# EAGLE design esp8266-incubator (EAGLE 6.4)

## Sheet 1 of 7: CPU
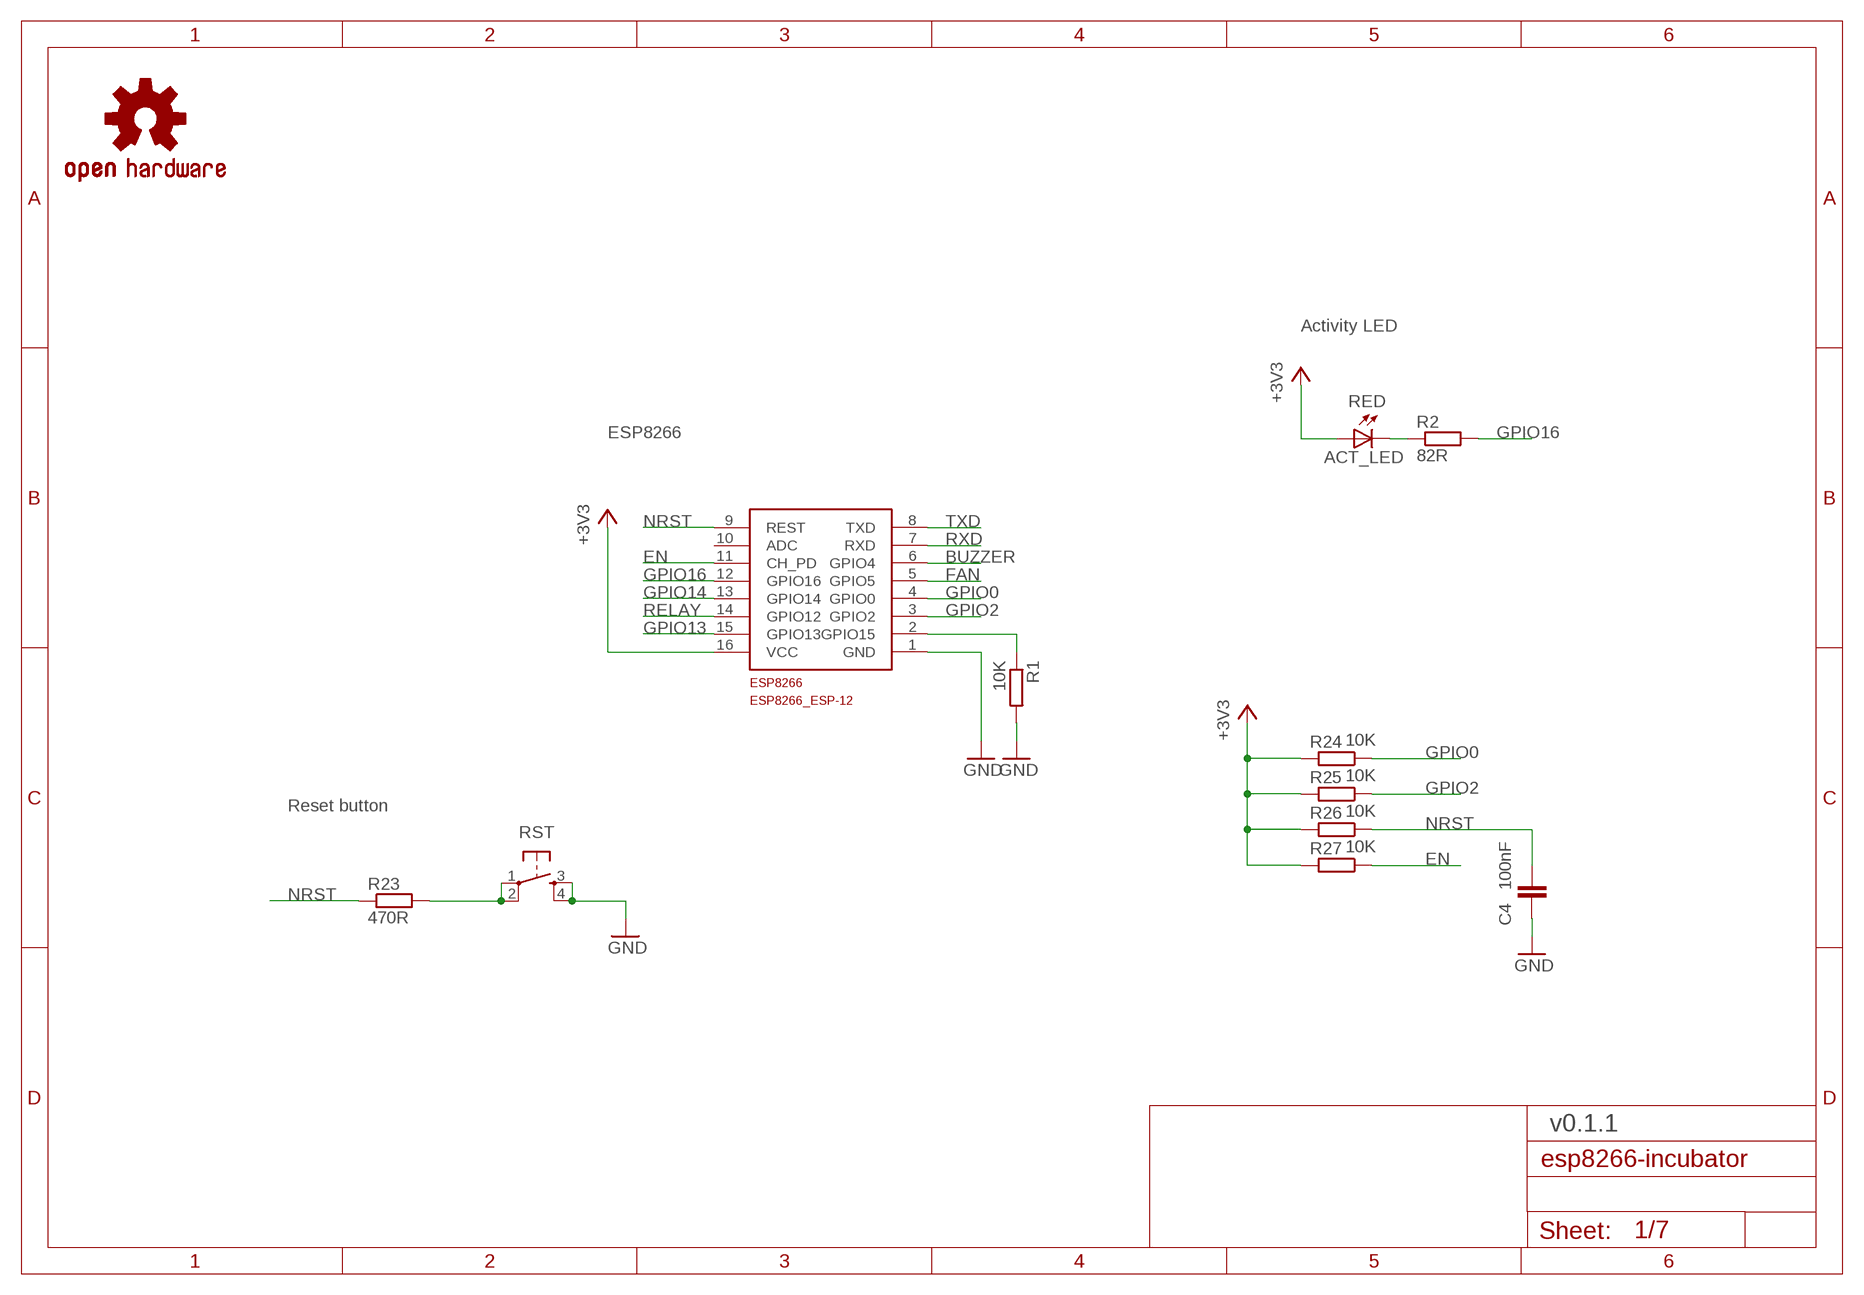
[diagram p0: schematic, sheet 1]

### Parts
ACT_LED  RED  LEDSMT1206  [1206]
C4  100nF  C-EUC0805  [C0805]
ESP8266  ESP8266_ESP-12  [ESP8266-ESP12]
R1  10K  R-EU_R0805  [R0805]
R2  82R  R-EU_R0805  [R0805]
R23  470R  R-EU_R0805  [R0805]
R24  10K  R-EU_R0805  [R0805]
R25  10K  R-EU_R0805  [R0805]
R26  10K  R-EU_R0805  [R0805]
R27  10K  R-EU_R0805  [R0805]
RST  TAC_SWITCHPTH  [TACTILE-PTH]
U$1000  OSHW-LOGOL  [OSHW-LOGO-L]

### Nets
+3V3: ACT_LED.A ESP8266.16(VCC) R24.2 R25.2 R26.2 R27.2 ; also sheet 2,3,4,5,6,7
BUZZER: ESP8266.6(GPIO4) ; also sheet 7
EN: ESP8266.11(CH_PD) R27.1
FAN: ESP8266.5(GPIO5) ; also sheet 3
GND: C4.1 ESP8266.1(GND) R1.2 RST.3 RST.4 ; also sheet 2,3,4,5,6,7
GPIO0: ESP8266.4(GPIO0) R24.1 ; also sheet 2
GPIO2: ESP8266.3(GPIO2) R25.1
GPIO13: ESP8266.15(GPIO13) ; also sheet 6
GPIO14: ESP8266.13(GPIO14) ; also sheet 6
GPIO16: ESP8266.12(GPIO16) R2.2
N$1: ACT_LED.C R2.1
N$5: ESP8266.2(GPIO15) R1.1
N$26: R23.2 RST.1 RST.2
NRST: C4.2 ESP8266.9(REST) R23.1 R26.1 ; also sheet 2
RELAY: ESP8266.14(GPIO12) ; also sheet 4
RXD: ESP8266.7(RXD) ; also sheet 2,6
TXD: ESP8266.8(TXD) ; also sheet 2,6
Unconnected: ESP8266.10(ADC)

### Notes on the sheet
- Activity LED
- ESP8266
- Reset button
- v0.1.1

## Sheet 2 of 7: Programming
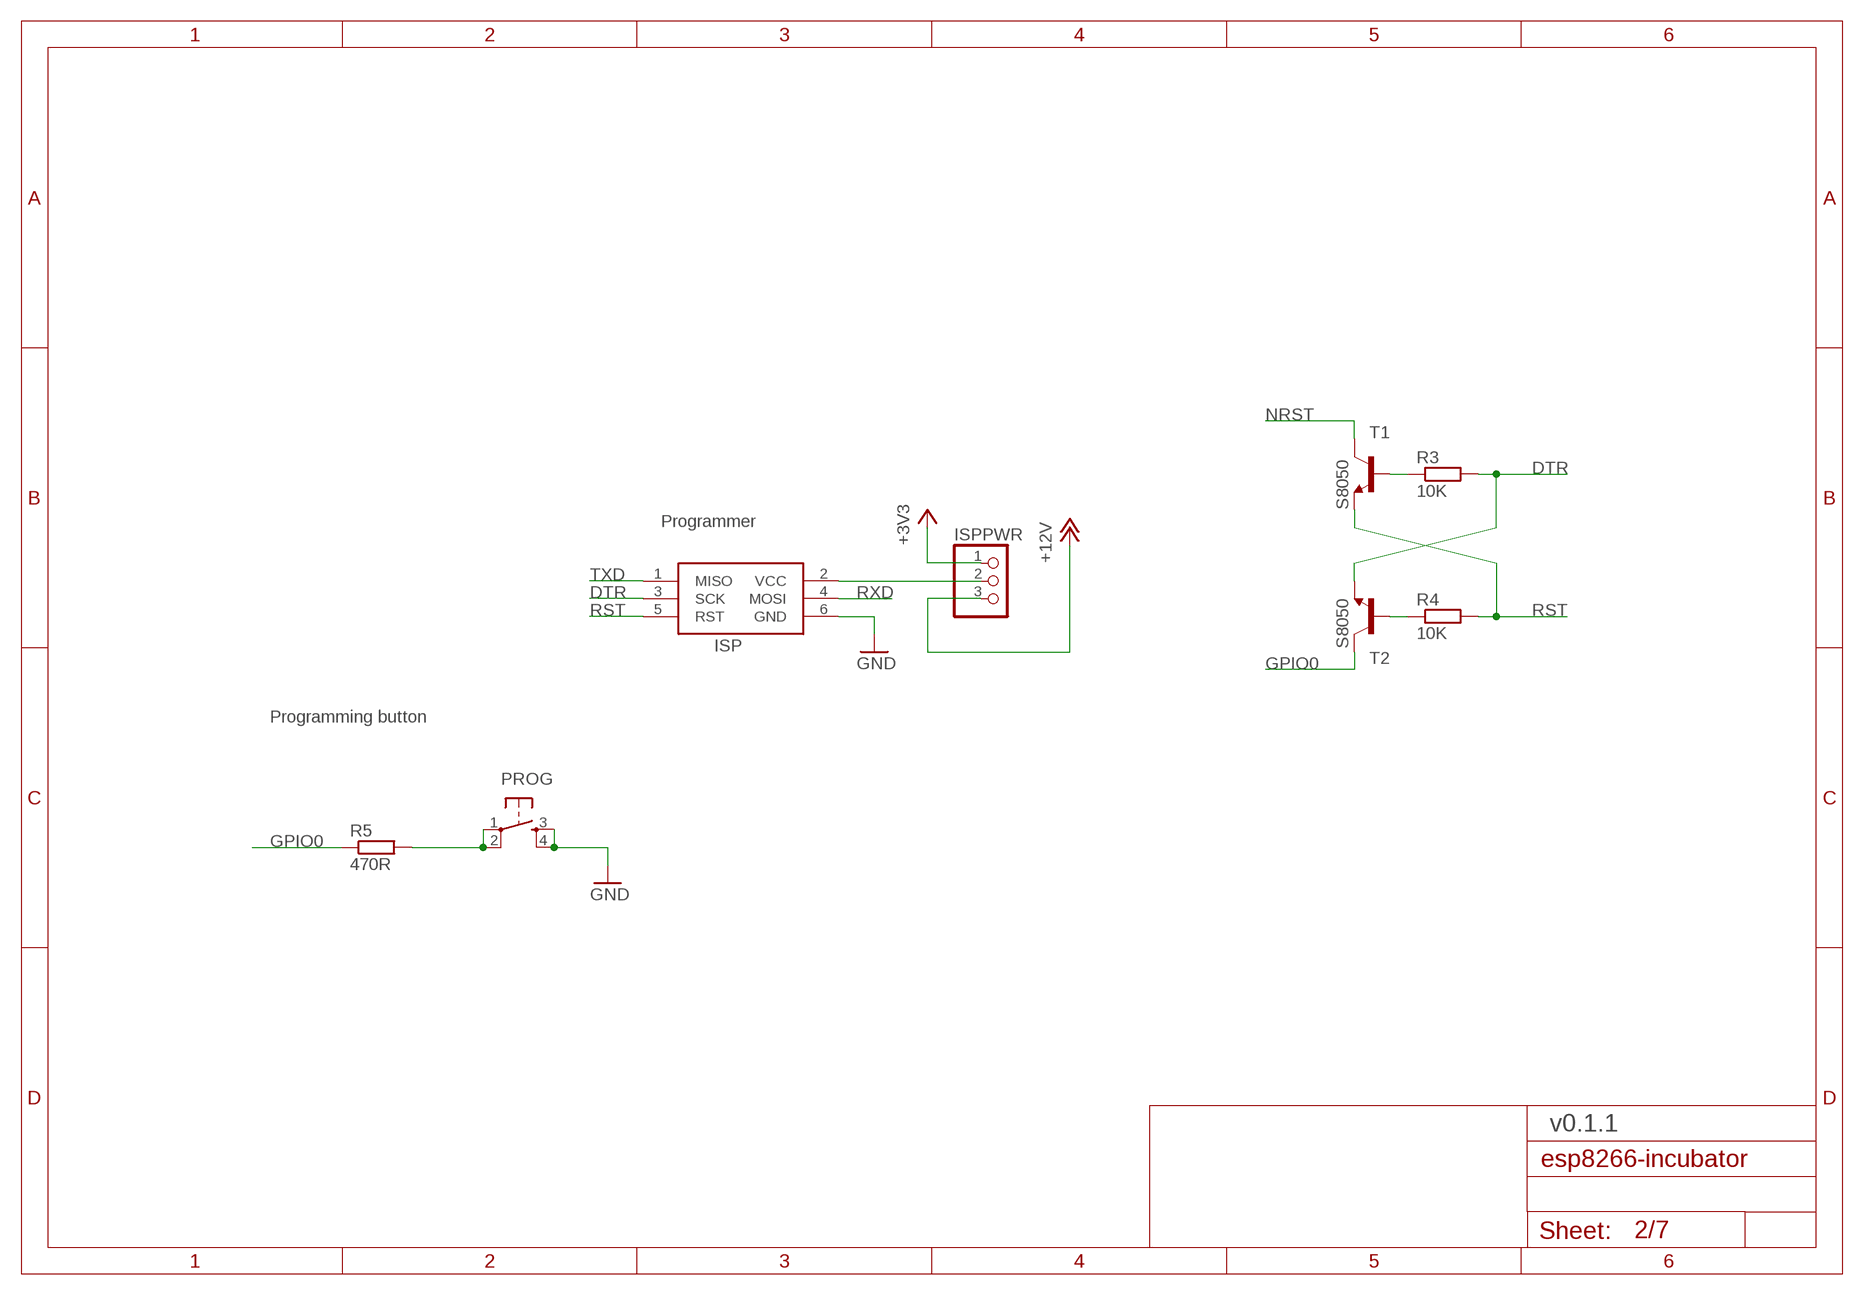
[diagram p1: schematic, sheet 2]

### Parts
ISP  AVRISP-6  [AVRISP]
ISPPWR  PINHD-1X3  [1X03]
PROG  TAC_SWITCHPTH  [TACTILE-PTH]
R3  10K  R-EU_R0805  [R0805]
R4  10K  R-EU_R0805  [R0805]
R5  470R  R-EU_R0805  [R0805]
T1  S8050  BC808-NPN-SOT23-BEC  [SOT23-BEC]
T2  S8050  BC808-NPN-SOT23-BEC  [SOT23-BEC]

### Nets
+3V3: ISPPWR.1 ; also sheet 1,3,4,5,6,7
+12V: ISPPWR.3 ; also sheet 3,5
DTR: ISP.3(SCK) R3.2 T2.E
GND: ISP.6(GND) PROG.3 PROG.4 ; also sheet 1,3,4,5,6,7
GPIO0: R5.1 T2.C ; also sheet 1
N$3: R3.1 T1.B
N$4: PROG.1 PROG.2 R5.2
N$6: ISP.2(VCC) ISPPWR.2
N$7: R4.1 T2.B
NRST: T1.C ; also sheet 1
RST: ISP.5(RST) R4.2 T1.E
RXD: ISP.4(MOSI) ; also sheet 1,6
TXD: ISP.1(MISO) ; also sheet 1,6

### Notes on the sheet
- Programmer
- Programming button
- v0.1.1

## Sheet 3 of 7: Fan
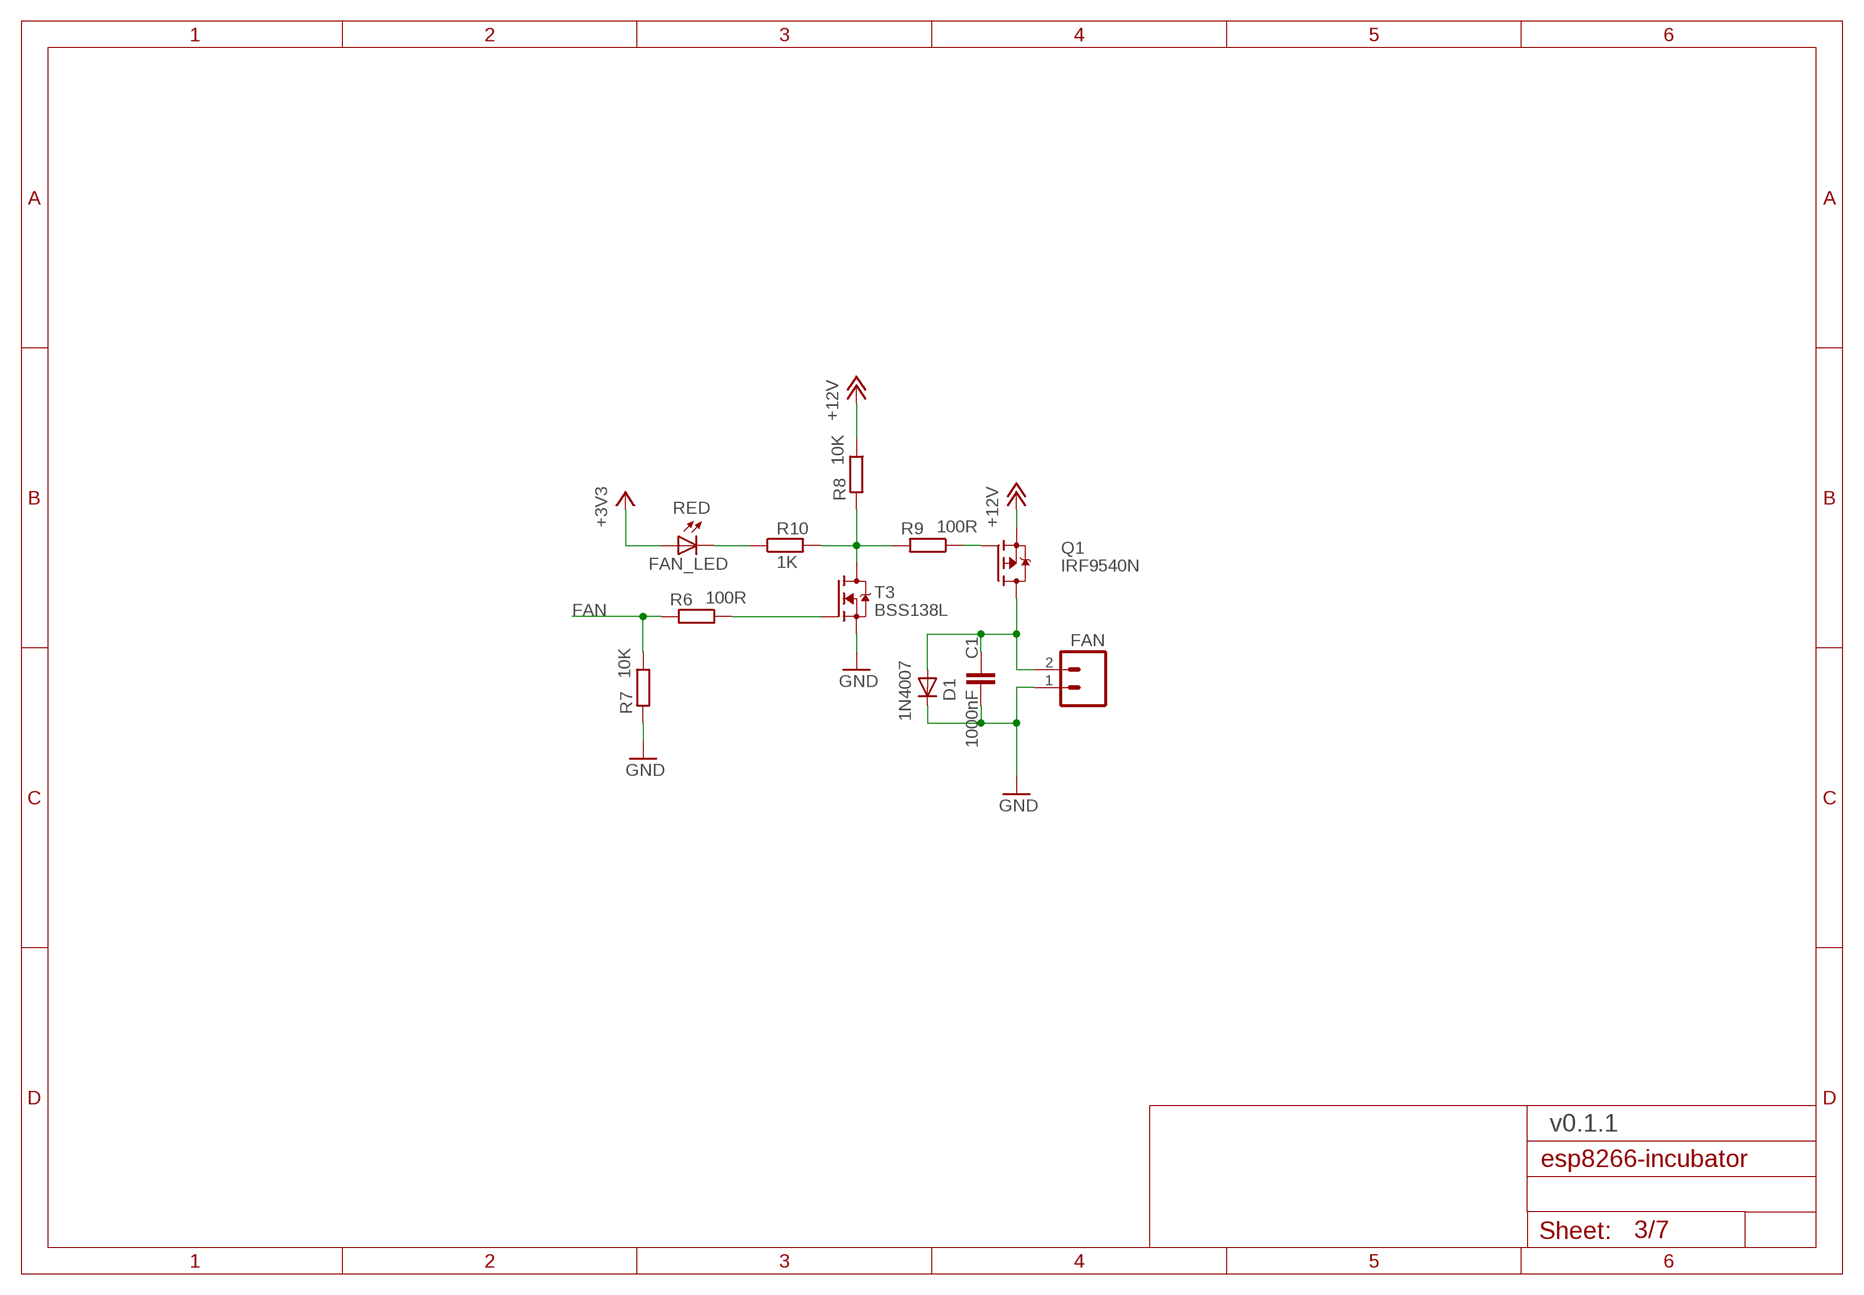
[diagram p2: schematic, sheet 3]

### Parts
C1  1000nF  C-EUC0805  [C0805]
D1  1N4007  DIODE-MELF-MLL41  [MELF-MLL41]
FAN  M025MM  [SCREWTERMINAL-5MM-2]
FAN_LED  RED  LEDSMT1206  [1206]
Q1  IRF9540N  MOSFET-PGDS_TO220V  [TO220V]
R6  100R  R-EU_R0805  [R0805]
R7  10K  R-EU_R0805  [R0805]
R8  10K  R-EU_R0805  [R0805]
R9  100R  R-EU_R0805  [R0805]
R10  1K  R-EU_R0805  [R0805]
T3  BSS138L  MOSFET-N-SOT23  [SOT23]

### Nets
+3V3: FAN_LED.A ; also sheet 1,2,4,5,6,7
+12V: Q1.3(S) R8.1 ; also sheet 2,5
FAN: R6.2 R7.1 ; also sheet 1
GND: C1.1 D1.C FAN.1 R7.2 T3.2(S) ; also sheet 1,2,4,5,6,7
N$18: Q1.1(G) R9.1
N$22: FAN_LED.C R10.1
N$23: R6.1 T3.1(G)
N$24: R8.2 R9.2 R10.2 T3.3(D)
N$25: C1.2 D1.A FAN.2 Q1.2(D)

### Notes on the sheet
- v0.1.1

## Sheet 4 of 7: Relays
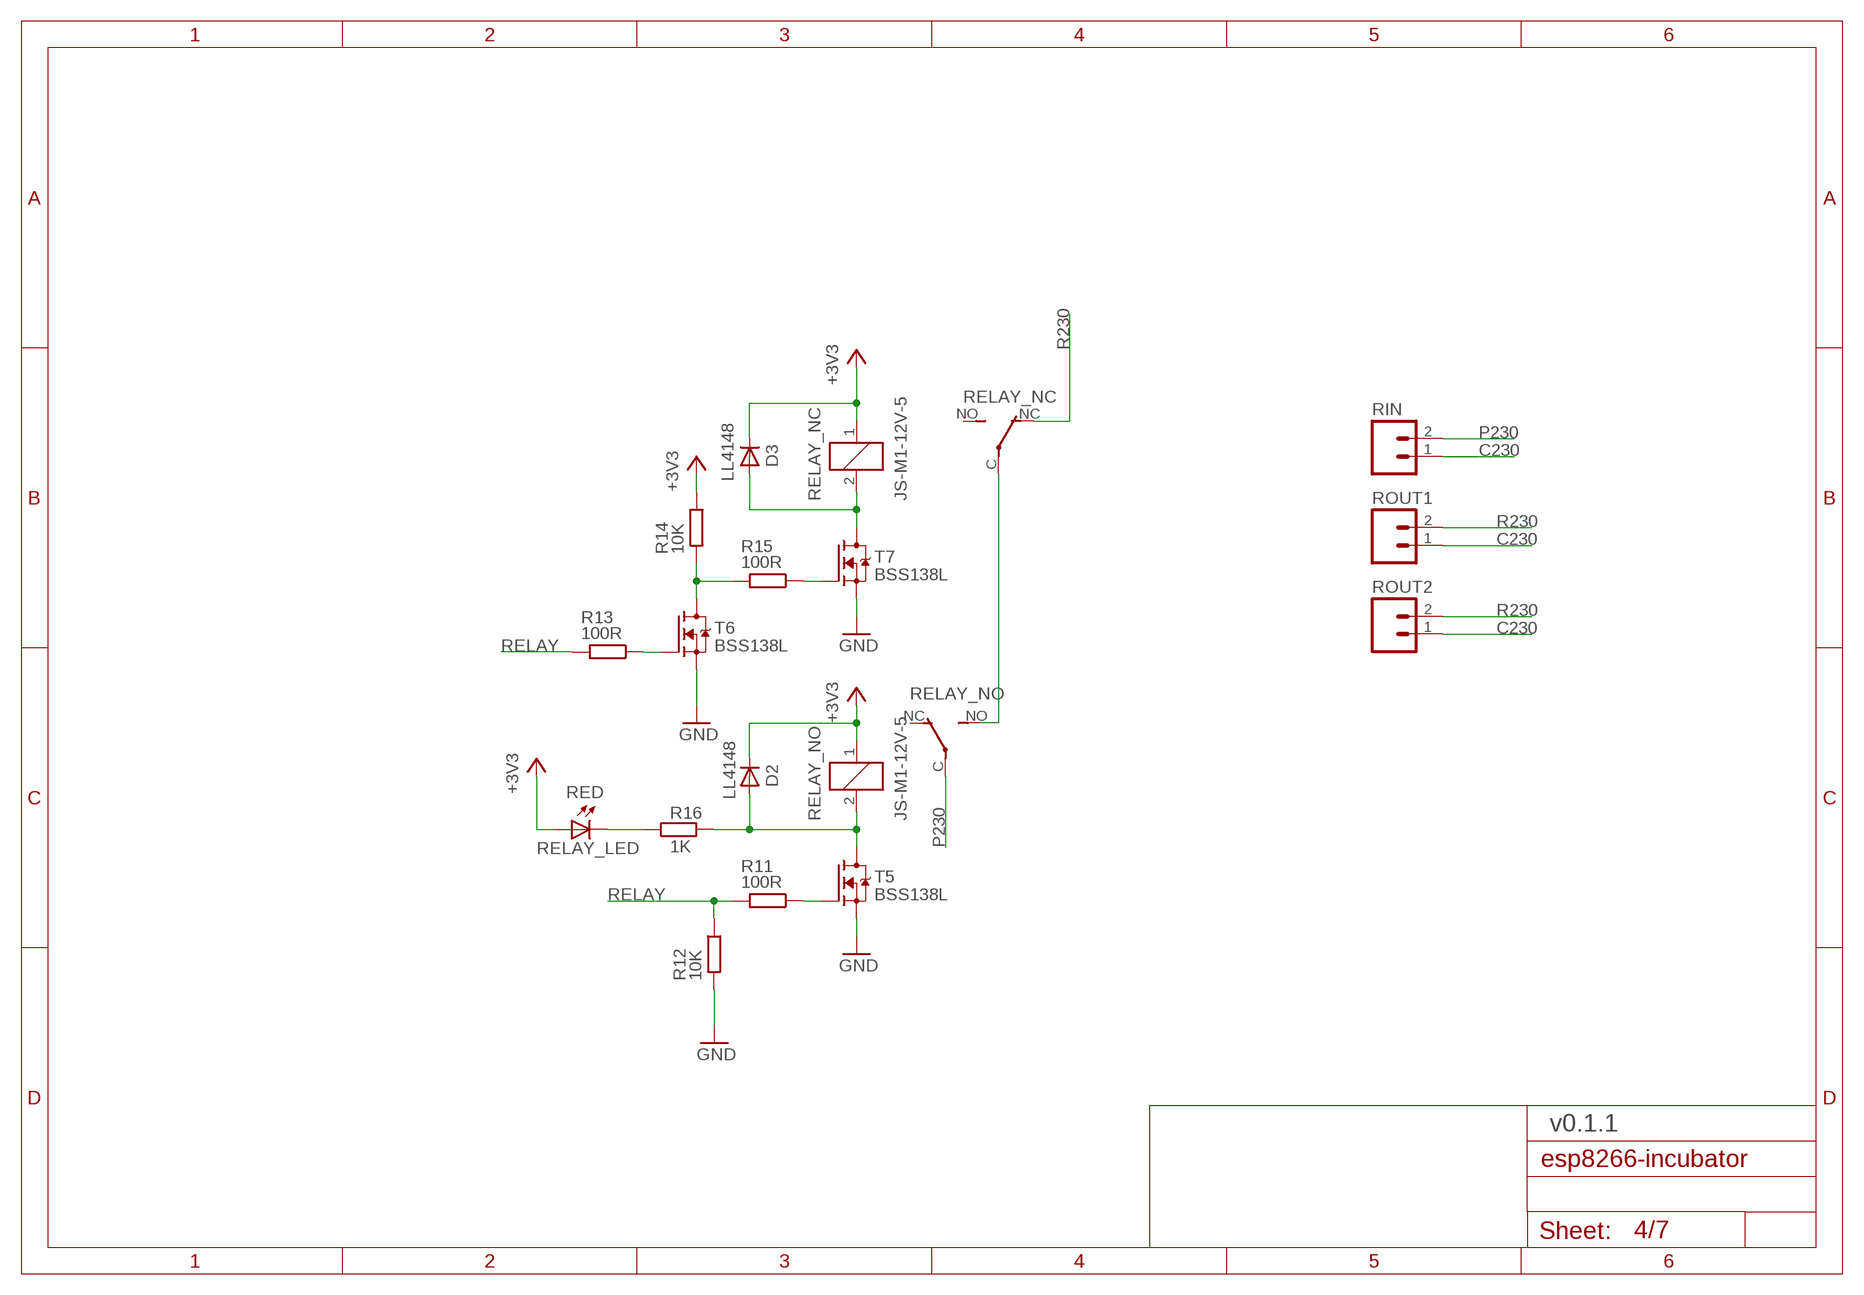
[diagram p3: schematic, sheet 4]

### Parts
D2  LL4148  PMLL4150  [SOD80C]
D3  LL4148  PMLL4150  [SOD80C]
R11  100R  R-EU_R0805  [R0805]
R12  10K  R-EU_R0805  [R0805]
R13  100R  R-EU_R0805  [R0805]
R14  10K  R-EU_R0805  [R0805]
R15  100R  R-EU_R0805  [R0805]
R16  1K  R-EU_R0805  [R0805]
RELAY_LED  RED  LEDSMT1206  [1206]
RELAY_NC  JS-M1-12V-5  [JS-M]
RELAY_NO  JS-M1-12V-5  [JS-M]
RIN  M025MM  [SCREWTERMINAL-5MM-2]
ROUT1  M025MM  [SCREWTERMINAL-5MM-2]
ROUT2  M025MM  [SCREWTERMINAL-5MM-2]
T5  BSS138L  MOSFET-N-SOT23  [SOT23]
T6  BSS138L  MOSFET-N-SOT23  [SOT23]
T7  BSS138L  MOSFET-N-SOT23  [SOT23]

### Nets
+3V3: D2.C D3.C R14.1 RELAY_LED.A RELAY_NC.1 RELAY_NO.1 ; also sheet 1,2,3,5,6,7
C230: RIN.1 ROUT1.1 ROUT2.1
GND: R12.2 T5.2(S) T6.2(S) T7.2(S) ; also sheet 1,2,3,5,6,7
N$9: D2.A R16.2 RELAY_NO.2 T5.3(D)
N$11: R11.1 T5.1(G)
N$12: R13.1 T6.1(G)
N$13: R14.2 R15.2 T6.3(D)
N$14: R15.1 T7.1(G)
N$15: R16.1 RELAY_LED.C
N$16: D3.A RELAY_NC.2 T7.3(D)
N$17: RELAY_NC.C(2:P) RELAY_NO.NO(2:S)
P230: RELAY_NO.C(2:P) RIN.2
R230: RELAY_NC.NC(2:O) ROUT1.2 ROUT2.2
RELAY: R11.2 R12.1 R13.2 ; also sheet 1
Unconnected: RELAY_NC.NO(2:S) RELAY_NO.NC(2:O)

### Notes on the sheet
- v0.1.1

## Sheet 5 of 7: Power
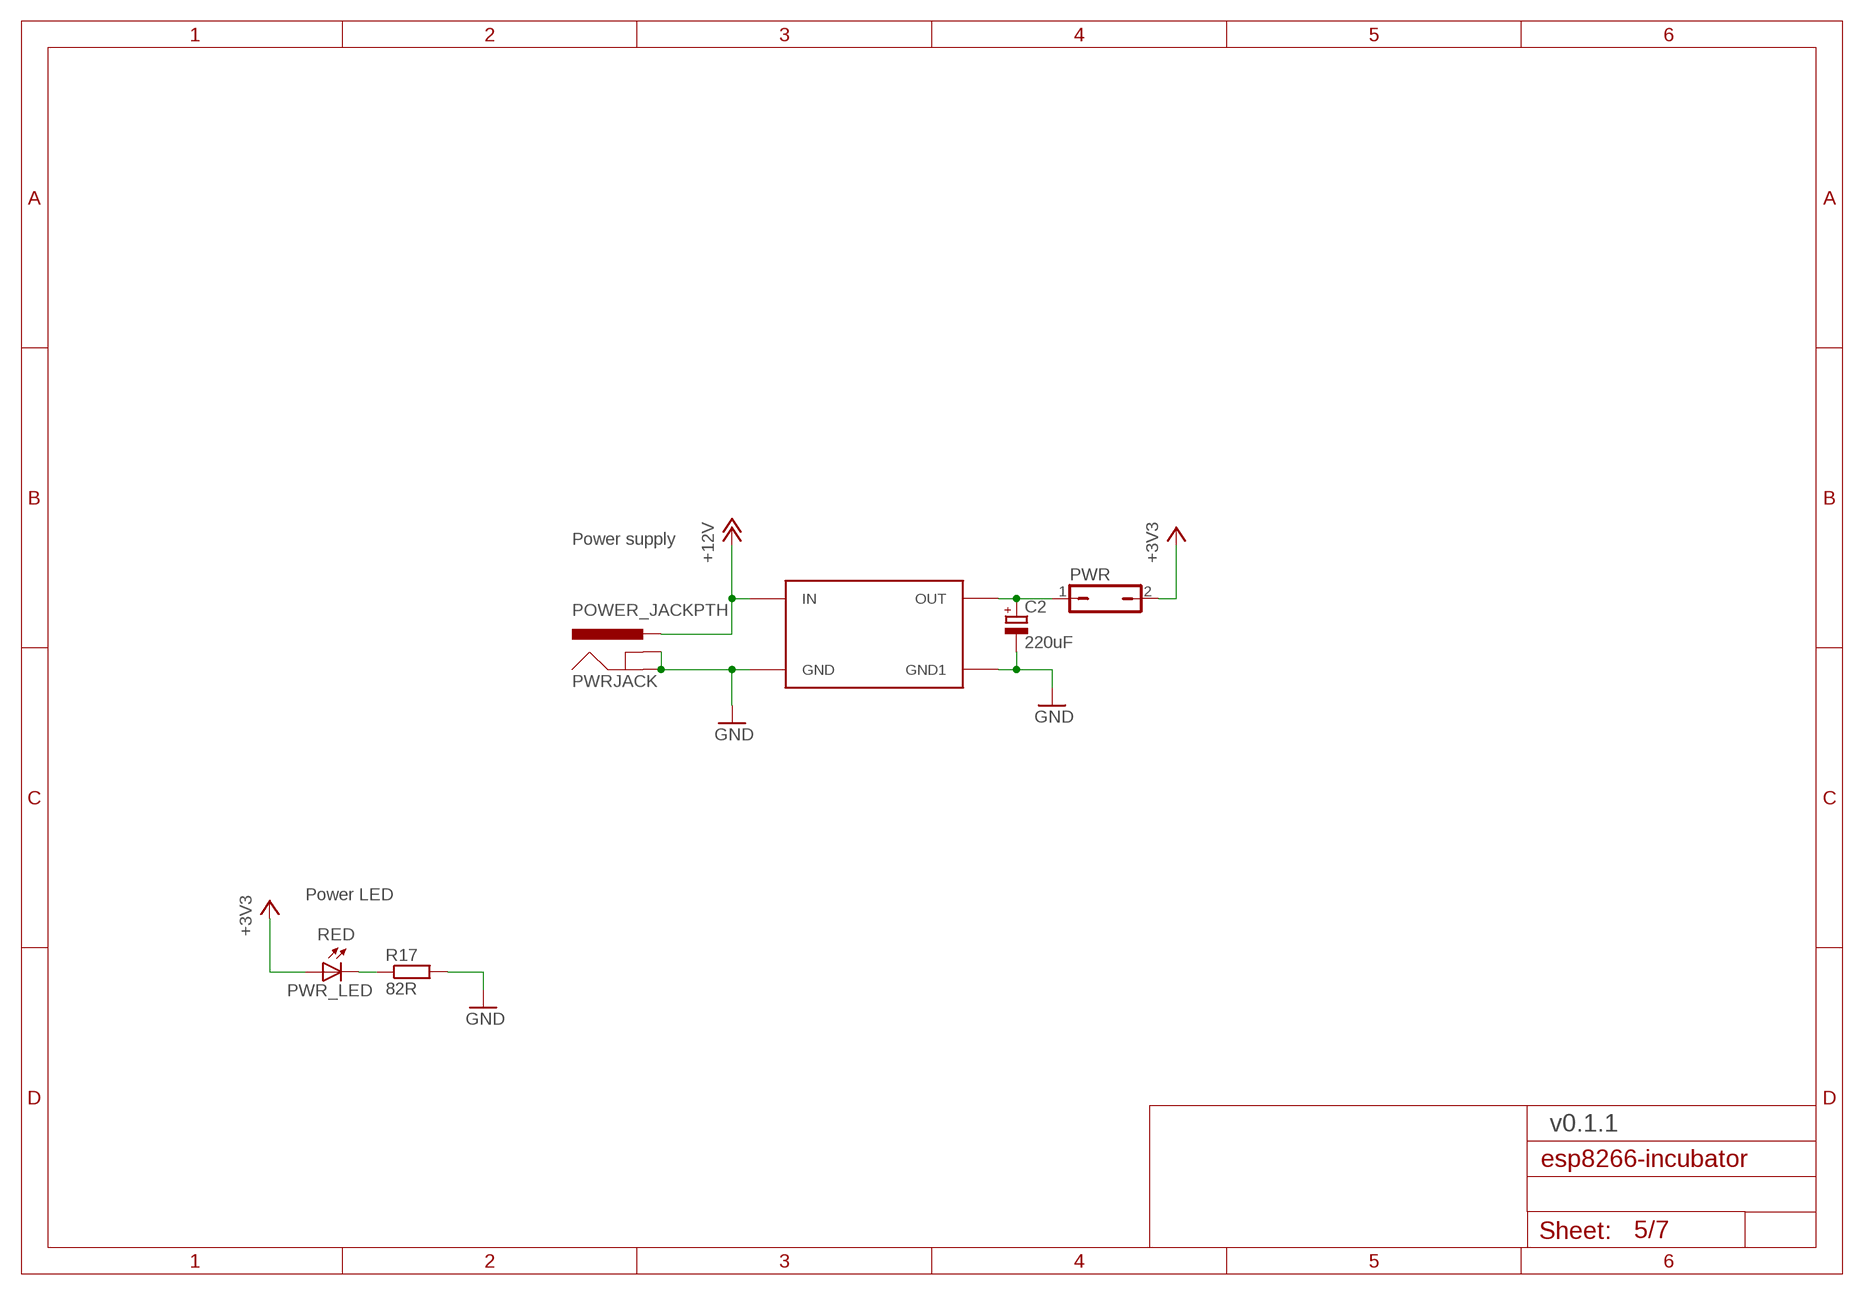
[diagram p4: schematic, sheet 5]

### Parts
C2  220uF  CPOL-EUE2.5-6  [E2,5-6]
PWR  JP1Q  [JP1]
PWR_LED  RED  LEDSMT1206  [1206]
PWR_SUPPLY  DC-DC-SMALL  [DC-DC]
PWRJACK  POWER_JACKPTH  [POWER_JACK_PTH]
R17  82R  R-EU_R0805  [R0805]

### Nets
+3V3: PWR.2 PWR_LED.A ; also sheet 1,2,3,4,6,7
+12V: PWR_SUPPLY.P$1(IN) PWRJACK.PWR ; also sheet 2,3
GND: C2.- PWR_SUPPLY.P$3(GND) PWR_SUPPLY.P$4(GND1) PWRJACK.GND PWRJACK.GNDBREAK R17.2 ; also sheet 1,2,3,4,6,7
N$2: C2.+ PWR.1 PWR_SUPPLY.P$2(OUT)
N$21: PWR_LED.C R17.1

### Notes on the sheet
- Power supply
- Power LED
- v0.1.1

## Sheet 6 of 7: Sensor
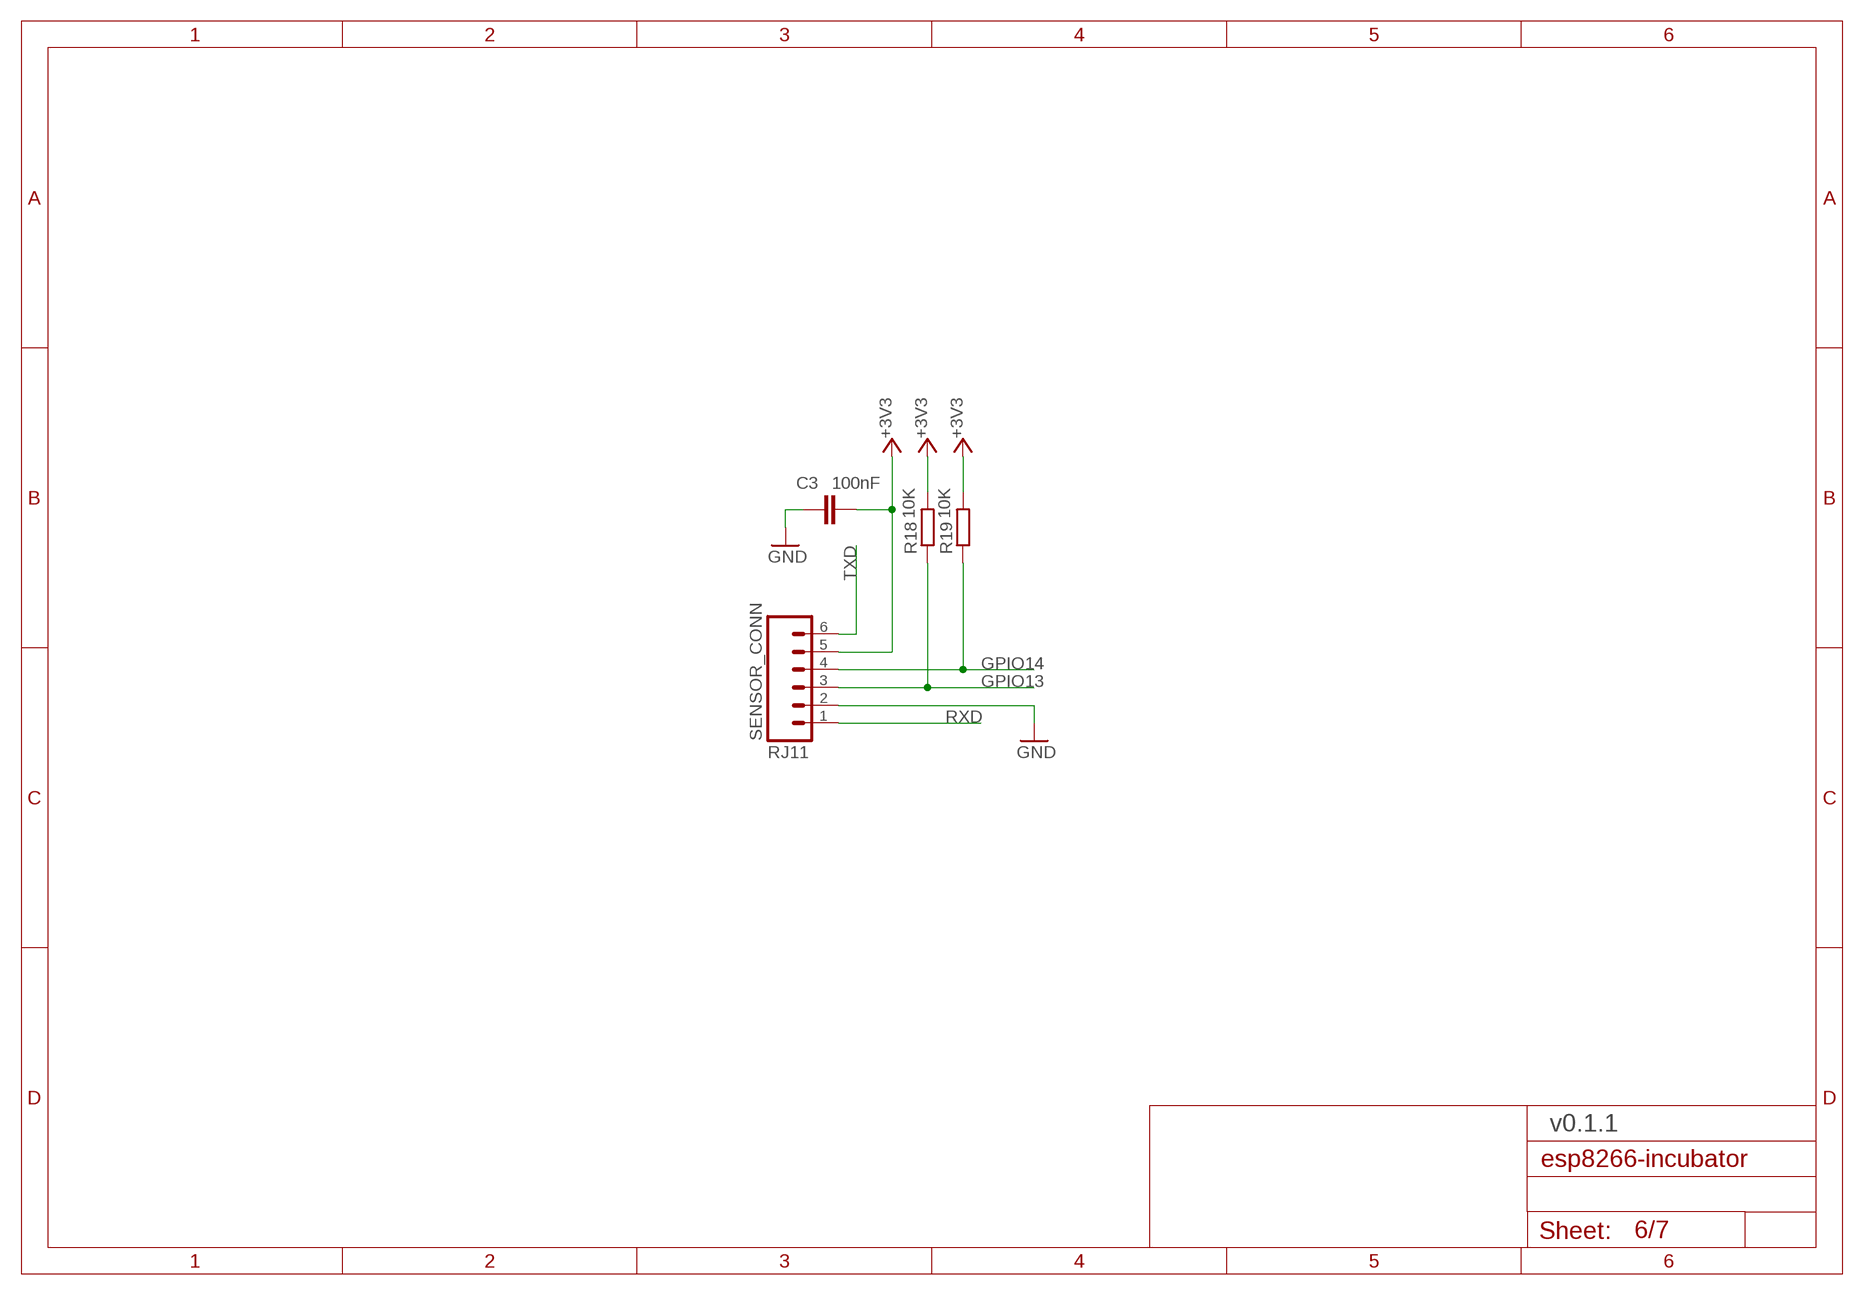
[diagram p5: schematic, sheet 6]

### Parts
C3  100nF  C-EUC0805  [C0805]
R18  10K  R-EU_R0805  [R0805]
R19  10K  R-EU_R0805  [R0805]
SENSOR_CONN  RJ11  RJ11-6PTH  [RJ11-6]

### Nets
+3V3: C3.2 R18.2 R19.2 SENSOR_CONN.5 ; also sheet 1,2,3,4,5,7
GND: C3.1 SENSOR_CONN.2 ; also sheet 1,2,3,4,5,7
GPIO13: R18.1 SENSOR_CONN.3 ; also sheet 1
GPIO14: R19.1 SENSOR_CONN.4 ; also sheet 1
RXD: SENSOR_CONN.1 ; also sheet 1,2
TXD: SENSOR_CONN.6 ; also sheet 1,2

### Notes on the sheet
- v0.1.1

## Sheet 7 of 7: Alarm
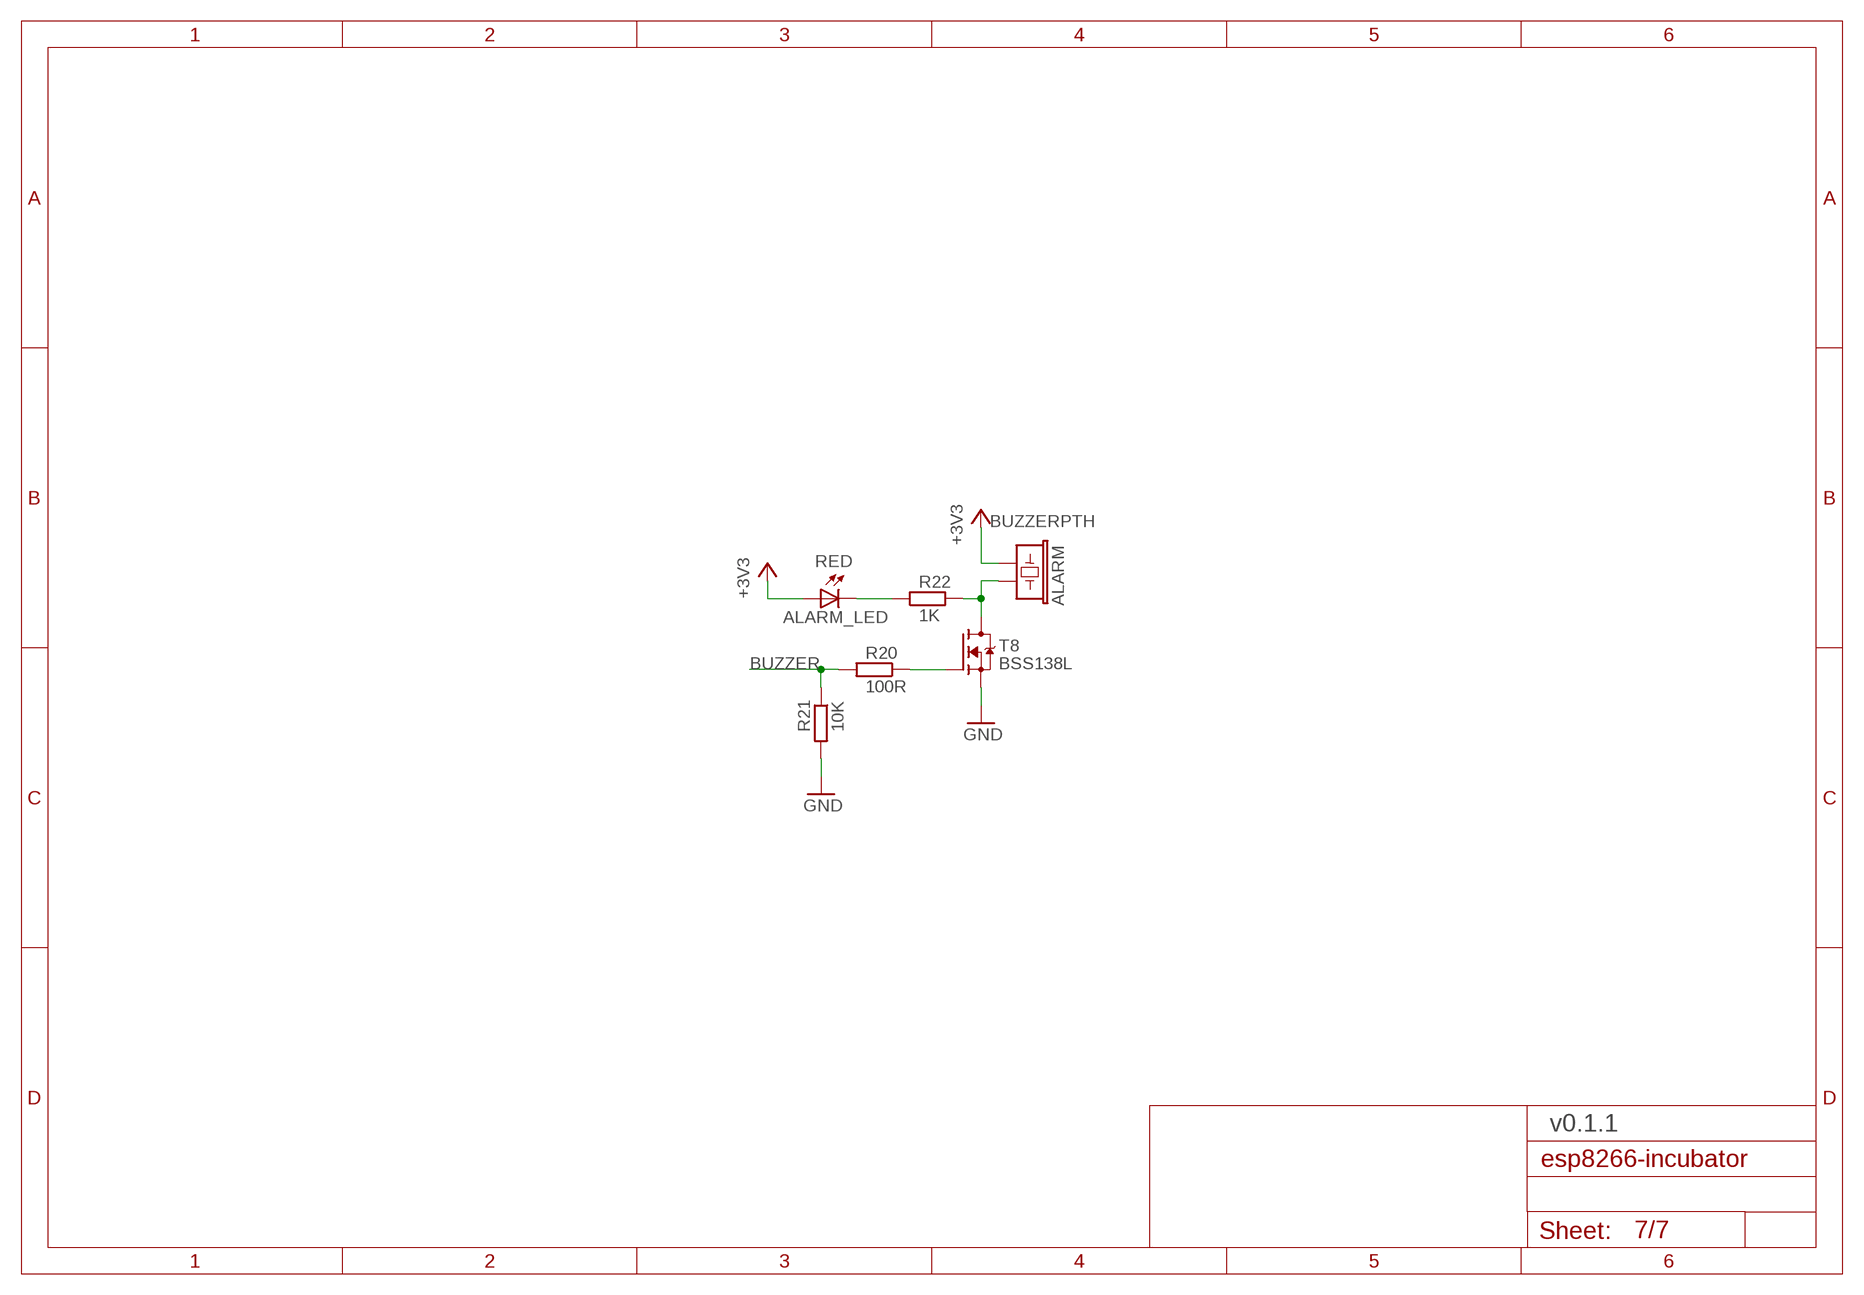
[diagram p6: schematic, sheet 7]

### Parts
ALARM  BUZZERPTH  [BUZZER-12MM]
ALARM_LED  RED  LEDSMT1206  [1206]
R20  100R  R-EU_R0805  [R0805]
R21  10K  R-EU_R0805  [R0805]
R22  1K  R-EU_R0805  [R0805]
T8  BSS138L  MOSFET-N-SOT23  [SOT23]

### Nets
+3V3: ALARM.+ ALARM_LED.A ; also sheet 1,2,3,4,5,6
BUZZER: R20.2 R21.1 ; also sheet 1
GND: R21.2 T8.2(S) ; also sheet 1,2,3,4,5,6
N$8: R20.1 T8.1(G)
N$19: ALARM_LED.C R22.1
N$20: ALARM.- R22.2 T8.3(D)

### Notes on the sheet
- v0.1.1

## Library data of the parts
ACT_LED ALARM_LED FAN_LED PWR_LED RELAY_LED = led:LED: LED OSRAM: - CHIPLED LG R971, LG N971, LY N971, LG Q971, LY Q971, LO R971, LY R971 LH N974, LH R974 LS Q976, LO Q976, LY Q976 LO Q996 - Hyper CHIPLED LW Q18S LB Q993, LB Q99A, LB R99A - SideLED LS A670, LO A670, LY A670, LG A670, LP A670 LB A673, LV A673, LT A673, LW A673 LH A674 LY A675 LS A676, LA A676, LO A676, LY A676, LW A676 LS A679, LY A679, LG A679 - Hyper Micro SIDELED® LS Y876, LA Y876, LO Y876, LY Y876 LT Y87S - SmartLED LW L88C, LW L88S LB L89C, LB L89S, LG L890 LS L89K, LO L89K, LY L89K LS L896, LA L896, LO L896, LY L896 - TOPLED LS T670, LO T670, LY T670, LG T670, LP T670 LSG T670, LSP T670, LSY T670, LOP T670, LYG T670 LG T671, LOG T671, LSG T671 LB T673, LV T673, LT T673, LW T673 LH T674 LS T676, LA T676, LO T676, LY T676, LB T676, LH T676, LSB T676, LW T676 LB T67C, LV T67C, LT T67C, LS T67K, LO T67K, LY T67K, LW E67C LS E67B, LA E67B, LO E67B, LY E67B, LB E67C, LV E67C, LT E67C LW T67C LS T679, LY T679, LG T679 LS T770, LO T770, LY T770, LG T770, LP T770 LB T773, LV T773, LT T773, LW T773 LH T774 LS E675, LA E675, LY E675, LS T675 LS T776, LA T776, LO T776, LY T776, LB T776 LHGB T686 LT T68C, LB T68C - Hyper Mini TOPLED® LB M676 - Mini TOPLED Santana® LG M470 LS M47K, LO M47K, LY M47K Source: http://www.osram.convergy.de LUXEON: - LUMILED® LXK2-PW12-R00, LXK2-PW12-S00, LXK2-PW14-U00, LXK2-PW14-V00 LXK2-PM12-R00, LXK2-PM12-S00, LXK2-PM14-U00 LXK2-PE12-Q00, LXK2-PE12-R00, LXK2-PE12-S00, LXK2-PE14-T00, LXK2-PE14-U00 LXK2-PB12-K00, LXK2-PB12-L00, LXK2-PB12-M00, LXK2-PB14-N00, LXK2-PB14-P00, LXK2-PB14-Q00 LXK2-PR12-L00, LXK2-PR12-M00, LXK2-PR14-Q00, LXK2-PR14-R00 LXK2-PD12-Q00, LXK2-PD12-R00, LXK2-PD12-S00 LXK2-PH12-R00, LXK2-PH12-S00 LXK2-PL12-P00, LXK2-PL12-Q00, LXK2-PL12-R00 Source: www.luxeon.com KINGBRIGHT: KA-3528ASYC Source: www.kingbright.com
ALARM = SparkFun:BUZZER: Buzzer 12mm Spark Fun Electronics SKU : Comp-Buzzer
C1 C3 C4 = rcl:C-EU: CAPACITOR, European symbol
C2 = rcl:CPOL-EU: POLARIZED CAPACITOR, European symbol
D1 = diode:DIODE-: DIODE
D2 D3 = diode:PMLL4150: DIODE high speed
ESP8266 = ESP8266-ESP12:ESP8266_ESP-12
FAN RIN ROUT1 ROUT2 = SparkFun-Connectors:M02: Standard 2-pin 0.1" header. Use with - straight break away headers ( PRT-00116) - right angle break away headers (PRT-00553) - swiss pins (PRT-00743) - machine pins (PRT-00117) - female headers (PRT-00115) Molex polarized connector foot print use with: PRT-08233 with associated crimp pins and housings. 2.54_SCREWTERM for use with PRT-10571. 3.5mm Screw Terminal footprints for PRT-08084 5mm Screw Terminal footprints for use with PRT-08432; STOREFRONT_ID: PRT-08432
ISP = adafruit:AVRISP: AVR ISP HEADER Standard 6 pin header for AVR programming
ISPPWR = pinhead:PINHD-1X3: PIN HEADER
PROG RST = SparkFun-Retired:TAC_SWITCH: Momentary Switch Button commonly used for reset or general input. Spark Fun Electronics SKU : COM-00097 SMT- SWCH-08247
PWR = jumper:JP1Q: JUMPER
PWR_SUPPLY = OK1CDJ-E6:DC-DC-SMALL
PWRJACK = SparkFun-Connectors:POWER_JACK: Power Jack This is the standard 5.5mm barrel jack for power. The PTH is the most common, proven, reliable, footprint. The Slot footprint only works if the mill layer is transmitted to the PCB fab house so be warned. Mating wall wart : TOL-00298 (and others); PROD_ID: CONN-08197
Q1 = adafruit:MOSFET-P
R1-R27 = rcl:R-EU_: RESISTOR, European symbol
RELAY_NC RELAY_NO = relay:JS-M1*: Automotive Ultra-Miniature Power Relay NAiS Source: http://www.mew-europe.com/.. en_ds_61211_0000.pdf
SENSOR_CONN = SparkFun-Connectors:RJ11-6: RJ11 Jack Simple 6 pin RJ11 jack. Commonly found on CAT3 devices and Microchip programmers. SKU: PRT-00132; PROD_ID: CONN-08590
T1 T2 = transistor:*-NPN-: NPN Transistror BF959 corrected 2008.03.06
T3 T5-T8 = we-transistor:MOSFET-N: N-Channel MOSFET TSM3404, IRLML2502 (Vgs>=+/-20V, Vds>=20V, Id>=3A + Rds<=0.05Ohm @ Vgs=4.5V) BSS138 (Vgs>=+/-20V, Vds>=40V, Id>=0.2A + Rds<=3Ohm @ Vgs=4.5V)
U$1000 = SparkFun:OSHW-LOGO: Open Source Hardware Logo This logo indicates the piece of hardware it is found on incorporates a OSHW license and/or adheres to the definition of open source hardware found here: http://freedomdefined.org/OSHW

## Board
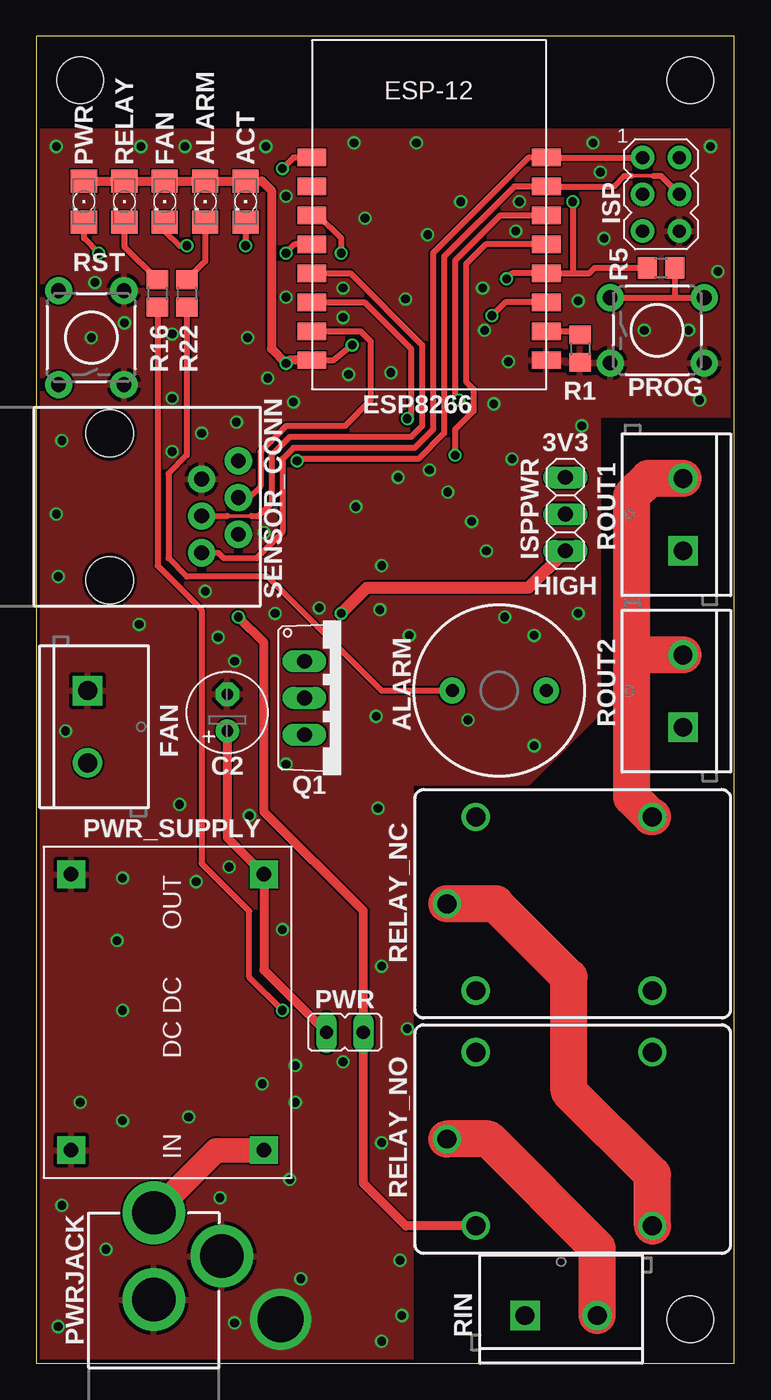
[diagram p7: board, top side]
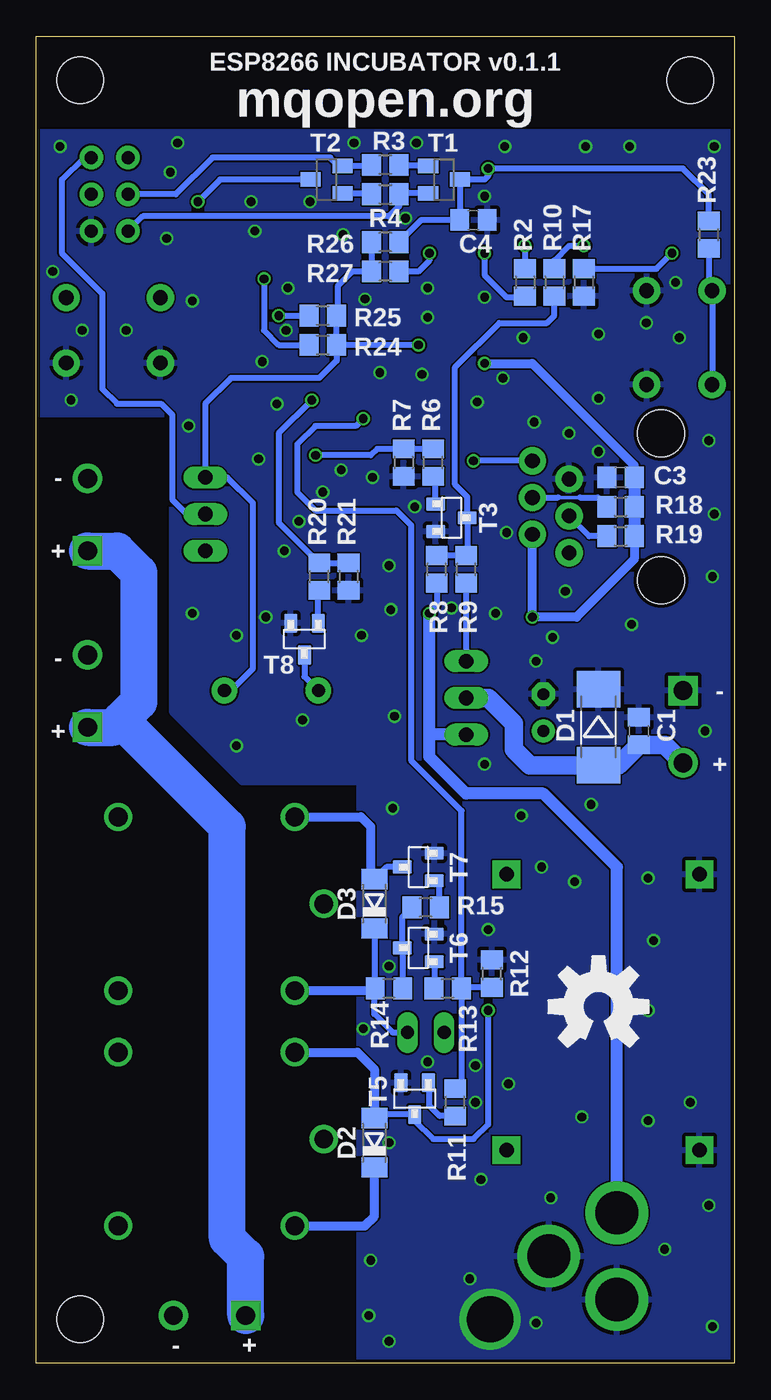
[diagram p8: board, bottom side, seen from below]

Size 48.26 x 91.69 mm. Coordinates in mm from the lower left corner, seen from the top.
Outline: 0,0 48.26,0 48.26,91.69 0,91.69 0,0
Copper layers (1*16): Top 0.035mm / dielectric 1.5mm / Bottom 0.035mm
Design rules "dirt_cheap_dirty_boards.v1": minimum track width 5mil, minimum drill 12mil, track to track 5mil, track to pad 5mil, pad to pad 5mil, via to via 5mil, smd to smd 0mil, copper to edge 10mil, drill to drill 10mil, minimum pad ring 10mil, minimum via ring 6mil, stop-mask expansion 2mil, vias tented up to drill 25mil, thermal gap 10mil
Holes 3.2 mm at 3.05,88.65 45.21,88.65 45.21,3.05

### Footprints (pad centres in the part's own frame; a part is rotated, then mirrored left to right if it is on the bottom)
1206 = smd 1.6 x 1.803: A -1.422,0; C 1.422,0
BUZZER-12MM = drill 0.9 pad 1.778: + 3.25,0; - -3.25,0
C0805 = smd 1.3 x 1.5: 1 -0.95,0; 2 0.95,0
E2,5-6 = drill 0.813 pad 1.6: + -1.27,0 | drill 0.813 pad 1.6 octagon: - 1.27,0
MELF-MLL41 = smd 2.5 x 3: A 2.625,0; C -2.625,0
SOD80C = smd 1.4 x 1.8: A 1.7,0; C -1.7,0
ESP8266-ESP12 = smd 2 x 1.2: 1 16.2,2; 2 16.2,4; 3 16.2,6; 4 16.2,8; 5 16.2,10; 6 16.2,12; 7 16.2,14; 8 16.2,16; 9 0,16; 10 0,14; 11 0,12; 12 0,10; 13 0,8; 14 0,6; 15 0,4; 16 0,2
SCREWTERMINAL-5MM-2 = drill 1.3 pad 2.032 square: 1 0,0 | drill 1.3 pad 2.032: 2 5,0
AVRISP = drill 0.9 pad 1.626: 1 -1.27,2.54; 2 1.27,2.54; 3 -1.27,0; 4 1.27,0; 5 -1.27,-2.54; 6 1.27,-2.54
1X03 = drill 1.016 long: 1 -2.54,0; 2 0,0; 3 2.54,0
TACTILE-PTH = drill 1.016 pad 1.88: 1 -3.251,2.261; 2 3.251,2.261; 3 -3.251,-2.261; 4 3.251,-2.261
JP1 = drill 0.914 long: 1 0,-1.27; 2 0,1.27
DC-DC = drill 1 pad 1.93 square: P$1 1.27,1.27; P$2 20.32,1.27; P$3 1.27,14.605; P$4 20.32,14.605
POWER_JACK_PTH = drill 2.997 pad 4.318: GND 0,7.7; GNDBREAK 4.7,10.7; PWR 0,13.7
TO220V = drill 1.016 long: 1 -2.54,-2.54; 2 0,-2.54; 3 2.54,-2.54
R0805 = smd 1.3 x 1.5: 1 -0.95,0; 2 0.95,0
JS-M = drill 1.3: 1 6.7,6; 2 6.7,-6; C 8.7,0; NC -5.5,-6; NO -5.5,6
RJ11-6 = drill 1.016 pad 1.88: 1 -3.175,8.89; 2 -1.905,6.35; 3 -0.635,8.89; 4 0.635,6.35; 5 1.905,8.89; 6 3.175,6.35 | hole 3.251: -5.08,0; 5.08,0
SOT23-BEC = smd 1 x 1.4: B -0.95,-1.1; C 0,1.1; E 0.95,-1.1
SOT23 = smd 1.3 x 0.9: 1 -1.1,0.95; 2 -1.1,-0.95; 3 1.1,0

### Placement (x,y rotation side)
ACT_LED  14.48,80.26 270 top
ALARM  32,46.48 0 top
ALARM_LED  11.68,80.26 270 top
C1  6.6,43.69 270 bottom
C2  13.21,44.96 90 top
C3  7.87,61.21 0 bottom
C4  18.03,78.99 180 bottom
D1  9.4,43.94 270 bottom
D2  24.89,15.24 90 bottom
D3  24.89,31.75 90 bottom
ESP8266  19.05,67.31 0 top
FAN  3.56,46.48 270 top
FAN_LED  8.89,80.26 270 top
ISP  43.18,80.77 0 top
ISPPWR  36.58,58.67 270 top
PROG  42.93,71.37 0 top
PWR  21.34,22.86 270 top
PWR_LED  3.3,80.26 270 top
PWR_SUPPLY  17.02,13.46 90 top
PWRJACK  8.13,-3.3 0 top
Q1  21.08,45.97 270 top
R1  37.59,70.1 270 top
R2  14.48,74.68 270 bottom
R3  24.13,82.8 180 bottom
R4  24.13,80.77 0 bottom
R5  43.18,75.69 0 top
R6  20.83,62.23 90 bottom
R7  22.86,62.23 270 bottom
R8  20.57,54.86 90 bottom
R9  18.54,54.86 90 bottom
R10  12.45,74.68 270 bottom
R11  19.3,18.03 90 bottom
R12  16.76,26.92 90 bottom
R13  19.81,25.91 0 bottom
R14  23.88,25.91 0 bottom
R15  21.34,31.5 180 bottom
R16  8.38,73.91 270 top
R17  10.41,74.68 270 bottom
R18  7.87,59.18 0 bottom
R19  7.87,57.15 0 bottom
R20  28.7,54.36 90 bottom
R21  26.67,54.36 270 bottom
R22  10.41,73.91 270 top
R23  1.78,77.98 270 bottom
R24  28.45,70.36 0 bottom
R25  28.45,72.39 0 bottom
R26  24.13,77.47 180 bottom
R27  24.13,75.44 180 bottom
RELAY_LED  6.1,80.26 270 top
RELAY_NC  37.08,31.75 180 top
RELAY_NO  37.08,15.49 180 top
RIN  33.78,3.3 0 top
ROUT1  44.7,56.13 90 top
ROUT2  44.7,43.94 90 top
RST  3.81,70.87 90 top
SENSOR_CONN  5.08,59.18 270 top
T1  20.07,81.79 270 bottom
T2  28.19,81.79 90 bottom
T3  19.56,58.42 0 bottom
T5  22.1,18.29 270 bottom
T6  21.84,28.7 180 bottom
T7  21.84,34.29 180 bottom
T8  29.72,50.04 270 bottom
U$1000  9.4,24.64 0 bottom

### Tracks (layer width: path | path; a pad name or v marks a point on that pad's centre or on a via)
+3V3  (via drill 0.6)
  Top 0.406: ESP8266.16 20.54,69.31 v21.84,70.36
  Top 0.61: v13.97,51.56 15.75,49.78 15.75,38.1 22.61,31.24 PWR.2 22.61,12.45 25.56,9.49 RELAY_NO.1 | ESP8266.16 17.49,69.31 v17.27,69.09 16.26,70.1 16.26,81.03 15.6,81.69 ACT_LED.A ALARM_LED.A FAN_LED.A RELAY_LED.A PWR_LED.A
  Bottom 0.406: v21.84,70.36 R24.2 | R24.2 R25.2 27.43,72.46 27.43,74.42 26.42,75.44 R27.2 R26.2 | R24.2 27.5,69.28 28.7,68.07 34.8,68.07 36.58,66.29 ISPPWR.1 35.05,61.21 33.27,59.44 33.27,48.01 34.8,46.48 ALARM.+ | D3.C 24.89,25.97 R14.1 24.89,25.84 24.89,24.13 23.62,22.86 PWR.2
  Bottom 0.61: SENSOR_CONN.5 v13.97,51.56 10.92,51.56 6.92,55.56 R19.2 | C3.2 6.92,62.04 13.97,69.09 v17.27,69.09 | RELAY_NO.1 25.56,9.49 24.89,10.16 D2.C | RELAY_NC.1 24.98,25.75 R14.1
  Bottom 0.813: C3.2 R18.2 R19.2
+12V  (via drill 0.6)
  Top 0.813: v21.08,51.82 22.86,53.59 34.04,53.59 ISPPWR.3
  Top 1.676: PWRJACK.PWR 8.13,10.41 12.45,14.73 PWR_SUPPLY.P$1
  Bottom 0.406: R8.1 20.57,52.32 v21.08,51.82
  Bottom 0.813: 21.08,43.43 21.08,41.91 18.54,39.37 13.21,39.37 8.13,34.29 PWRJACK.PWR | 21.08,43.43 v21.08,51.82 | Q1.3 21.08,43.43
BUZZER  (via drill 0.6)
  Top 0.406: v29.21,66.55 28.96,66.8 28.96,76.2 32.07,79.31 ESP8266.6
  Bottom 0.406: v29.21,66.55 31.5,64.26 31.5,58.1 R20.2 R21.1
C230
  Bottom 2.54: RIN.1 33.78,7.37 35.05,8.64 35.05,37.08 42.42,44.45 | ROUT2.1 42.93,43.94 42.42,44.45 | 42.42,44.45 41.15,45.72 41.15,54.61 42.67,56.13 ROUT1.1
DTR
  Bottom 0.406: R3.2 25.15,82.74 T2.E 27.37,82.74 27.94,83.31 36.07,83.31 38.61,80.77 ISP.3
EN  (via drill 0.6)
  Top 0.406: ESP8266.11 19.5,79.31 21.08,77.72 v21.08,76.71
  Bottom 0.406: v21.08,76.71 21.08,76.2 21.84,75.44 R27.1
FAN  (via drill 0.6)
  Top 0.406: v28.96,62.74 28.96,64.52 30.23,65.79 30.23,67.31 29.72,67.82 29.72,75.95 31.08,77.31 ESP8266.5
  Bottom 0.406: R6.2 R7.1 24.7,63.18 25.15,62.74 v28.96,62.74
GND  (via drill 0.6, 3.2)
  other vias: 17.02,29.97 17.27,41.4 17.91,20.57 5.59,29.21 3.05,18.03 12.7,11.43 23.88,15.24 25.15,7.11 23.88,27.43 18.29,5.84 17.53,12.7 25.65,23.11 13.72,2.79 4.83,7.87 1.78,10.92 1.52,2.54 23.88,1.52 23.62,38.35 19.56,52.2 9.91,38.61 2.03,43.69 1.52,54.36 1.78,63.75 11.43,64.26 7.11,51.05 16.51,51.82 27.18,61.72 28.45,60.2 38.99,82.3 23.88,55.12 21.59,68.33 16,68.07 9.4,71.12 6.1,71.88 4.06,74.68 21.21,74.3 21.21,72.26 24.51,68.45 25.53,73.53 32.64,69.22 30.99,71.37 30.86,74.3 33.15,78.23 33.4,80.26 29.34,80.26 27.05,77.98 21.97,84.33 26.29,84.33 17.27,80.64 15.88,84.07 7.24,84.07 10.29,84.07 14.61,70.87 1.4,84.07 39.24,77.72 46.61,84.07 38.48,84.33 47.12,75.44 45.09,71.37 42.04,71.37 37.47,73.41 37.72,64.77 45.85,66.55 31.62,66.29 30.1,58.17 31.11,56.13 32.89,62.48 37.47,51.82 34.42,42.67 34.42,50.29 32.38,51.56 23.75,52.07 23.5,44.7 25.78,50.29 13.34,34.29 11.05,33.27 15.62,19.3 10.54,17.02 5.97,24.38 5.97,16.76 5.97,33.53 21.21,20.83 25.27,3.3 25.02,61.21 13.84,65.02 9.4,66.67 3.81,70.87 1.4,58.67 17.27,73.66 17.78,66.42 22.73,79.12 16.89,3.05 22.1,59.18 12.57,50.16 29.84,44.45 14.73,37.85 13.72,48.51 11.68,53.34 17.91,18.03 9.4,62.99 15.75,57.4
  pour Bottom: -0.25,85.09 -0.25,-0.25 25.91,-0.25 25.91,40.13 34.04,40.13 38.86,44.96 38.86,65.53 48.51,65.53 48.51,85.09
  pour Top: -0.25,85.09 -0.25,-0.25 25.91,-0.25 25.91,40.13 34.04,40.13 38.86,44.96 38.86,65.53 48.51,65.53 48.51,85.09
GPIO0  (via drill 0.6)
  Top 0.406: 37.08,75.31 ESP8266.4 32.89,75.31 v32.51,74.93 | 37.08,75.31 38.23,75.31 38.61,75.69 R5.1 | v37.08,80.26 37.08,75.31
  Bottom 0.406: T2.C 35.56,81.79 v37.08,80.26 | v32.51,74.93 32.51,71.37 31.5,70.36 R24.1
GPIO2  (via drill 0.6)
  Top 0.406: ESP8266.3 32.42,73.31 v31.5,72.39
  Bottom 0.406: v31.5,72.39 R25.1
GPIO13
  Top 0.406: SENSOR_CONN.3 14.73,59.82 15.49,60.58 15.49,62.99 17.27,64.77 21.34,64.77 23.11,66.55 23.11,70.61 22.42,71.31 ESP8266.15
  Bottom 0.254: 12.19,59.82 10.67,59.82
  Bottom 0.406: SENSOR_CONN.3 12.19,59.82 | 10.67,59.82 9.46,59.82 R18.1
GPIO14
  Top 0.254: 13.21,58.55 14.86,58.55
  Top 0.406: SENSOR_CONN.4 13.21,58.55 | 14.86,58.55 15.37,58.55 16.26,59.44 16.26,62.74 17.53,64.01 25.91,64.01 26.67,64.77 26.67,70.36 21.72,75.31 ESP8266.13
  Bottom 0.406: R19.1 10.03,57.15 SENSOR_CONN.4
GPIO16  (via drill 0.6)
  Top 0.406: ESP8266.12 17.87,77.31 v17.27,76.71
  Bottom 0.406: v17.27,76.71 17.27,75.18 15.75,73.66 14.54,73.66 R2.2
N$1  (via drill 0.6)
  Top 0.406: ACT_LED.C v14.48,77.22
  Bottom 0.406: v14.48,77.22 R2.1
N$2
  Top 0.61: C2.+ 13.21,36.32 PWR_SUPPLY.P$2 15.75,27.18 PWR.1
N$3
  Bottom 0.406: T1.B 23.11,82.74 R3.1
N$4
  Top 0.406: PROG.1 44.2,73.64 | 44.2,73.64 PROG.2 | R5.2 44.13,73.7 44.2,73.64
N$5
  Top 0.406: ESP8266.2 37.34,71.31 R1.1
N$6
  Bottom 0.406: ISP.2 44.96,83.31 46.48,81.79 46.48,76.71 43.69,73.91 43.69,67.31 42.67,66.29 39.62,66.29 38.86,65.53 38.86,59.69 37.85,58.67 ISPPWR.2
N$7
  Bottom 0.406: T2.B 25.15,80.84 R4.1
N$8
  Bottom 0.406: T8.1 28.77,53.34 R20.1
N$9  (via drill 0.6)
  Top 0.406: R16.2 8.38,55.12 11.43,52.07 11.43,34.54 14.73,31.24 14.73,26.67 v17.02,24.38
  Bottom 0.406: 24.81,17.02 D2.A 24.64,17.19 T5.3 22.1,16.76 20.83,15.49 18.03,15.49 17.02,16.51 v17.02,24.38
  Bottom 0.61: RELAY_NO.2 26.07,21.49 24.89,20.32 D2.A
N$11
  Bottom 0.406: R11.1 20.39,17.08 21.08,17.78 21.08,19.32 T5.1
N$12
  Bottom 0.406: T6.1 20.74,25.93 R13.1
N$13
  Bottom 0.406: R15.2 22.94,30.84 T6.3 22.94,25.93 R14.2
N$14
  Bottom 0.406: R15.1 20.39,32.98 T7.1
N$15
  Top 0.406: RELAY_LED.C 6.1,77.15 R16.1
N$16
  Bottom 0.406: T7.3 24.05,34.29 D3.A
  Bottom 0.61: RELAY_NC.2 25.81,37.75 25.15,37.08 25.15,33.7 D3.A
N$17
  Top 2.54: RELAY_NO.NO 42.58,13.04 36.83,18.8 36.83,26.67 31.75,31.75 RELAY_NC.C
N$18
  Bottom 0.406: R9.1 Q1.1
N$19
  Top 0.406: ALARM_LED.C 11.68,76.13 R22.1
N$20
  Top 0.406: ALARM.- 23.88,46.48 16,54.36 10.41,54.36 9.14,55.63 9.14,61.47 10.41,62.74 R22.2
  Bottom 0.406: T8.3 29.72,47.45 ALARM.-
N$21  (via drill 0.6)
  Top 0.406: v4.32,76.71 3.3,77.72 PWR_LED.C
  Bottom 0.406: R17.1 5.4,75.63 v4.32,76.71
N$22  (via drill 0.6)
  Top 0.406: v10.41,77.22 9.91,77.22 8.89,78.23 FAN_LED.C
  Bottom 0.406: R10.1 12.45,76.2 11.43,77.22 v10.41,77.22
N$23
  Bottom 0.406: T3.1 20.66,61.11 R6.1
N$24
  Bottom 0.406: R8.2 R9.2 18.46,55.9 T3.3 18.46,59.86 19.3,60.71 19.3,68.83 16.26,71.88 12.95,71.88 12.45,72.39 R10.2
N$25
  Bottom 1.27: FAN.2 4.81,42.74 C1.2 8.03,41.32 D1.A 14.14,41.32 15.24,42.42 15.24,44.2 17.02,45.97 Q1.2
N$26
  Bottom 0.406: R23.2 1.78,74.35 RST.2 RST.1
NRST  (via drill 0.6)
  Top 0.406: ESP8266.9 17.78,83.31 v17.02,82.55
  Bottom 0.406: R26.1 21.66,78.99 C4.2 18.97,79.01 T1.C 17.27,81.79 17.02,82.04 v17.02,82.55 3.56,82.55 1.78,80.77 R23.1
P230
  Top 2.54: RIN.2 38.78,7.95 31.24,15.49 RELAY_NO.C
R230
  Top 2.54: ROUT1.2 42.34,61.13 41.15,59.94 41.15,48.94 | 41.15,48.94 41.15,39.12 42.51,37.75 RELAY_NC.NC | ROUT2.2 41.15,48.94
RELAY  (via drill 0.6)
  Top 0.406: v25.65,65.28 25.91,65.53 25.91,70.1 22.7,73.31 ESP8266.14
  Bottom 0.406: v25.65,65.28 26.16,64.77 28.96,64.77 30.23,63.5 30.23,60.2 28.96,58.93 23.37,58.93 22.35,57.91 22.35,41.66 18.86,38.17 R13.2 | R13.2 18.86,19.43 R11.2 | R12.1 18.8,25.97 R13.2
RST
  Bottom 0.406: T1.E 23.11,80.84 R4.2 23.18,79.94 23.88,79.25 40.89,79.25 ISP.5
RXD  (via drill 0.6)
  Top 0.254: 41.15,82.04 42.67,82.04
  Top 0.406: 41.15,82.04 40.64,82.04 39.91,81.31 ESP8266.7 33.05,81.31 28.19,76.45 28.19,64.26 26.42,62.48 18.16,62.48 v18.03,62.36 | 42.67,82.04 43.18,82.04 ISP.4
  Bottom 0.406: SENSOR_CONN.1 v18.03,62.36
TXD
  Top 0.406: ESP8266.8 ISP.1 | ESP8266.8 | ESP8266.8 34.03,83.31 27.43,76.71 27.43,64.52 26.16,63.25 17.78,63.25 17.02,62.48 17.02,57.4 15.24,55.63 12.95,55.63 12.57,56.01 SENSOR_CONN.6

### Text on the board
tNames: PWR | RELAY | FAN | ALARM | ACT | 3V3 | HIGH | PWR_SUPPLY
bNames: ESP8266 INCUBATOR v0.1.1 | mqopen.org | - | + | - | - | + | + | + | -